# Altium schematic sheet RMP_MAIN_ZERO.SchDoc
size Letter; SheetNumber: 6; SheetTotal: 7
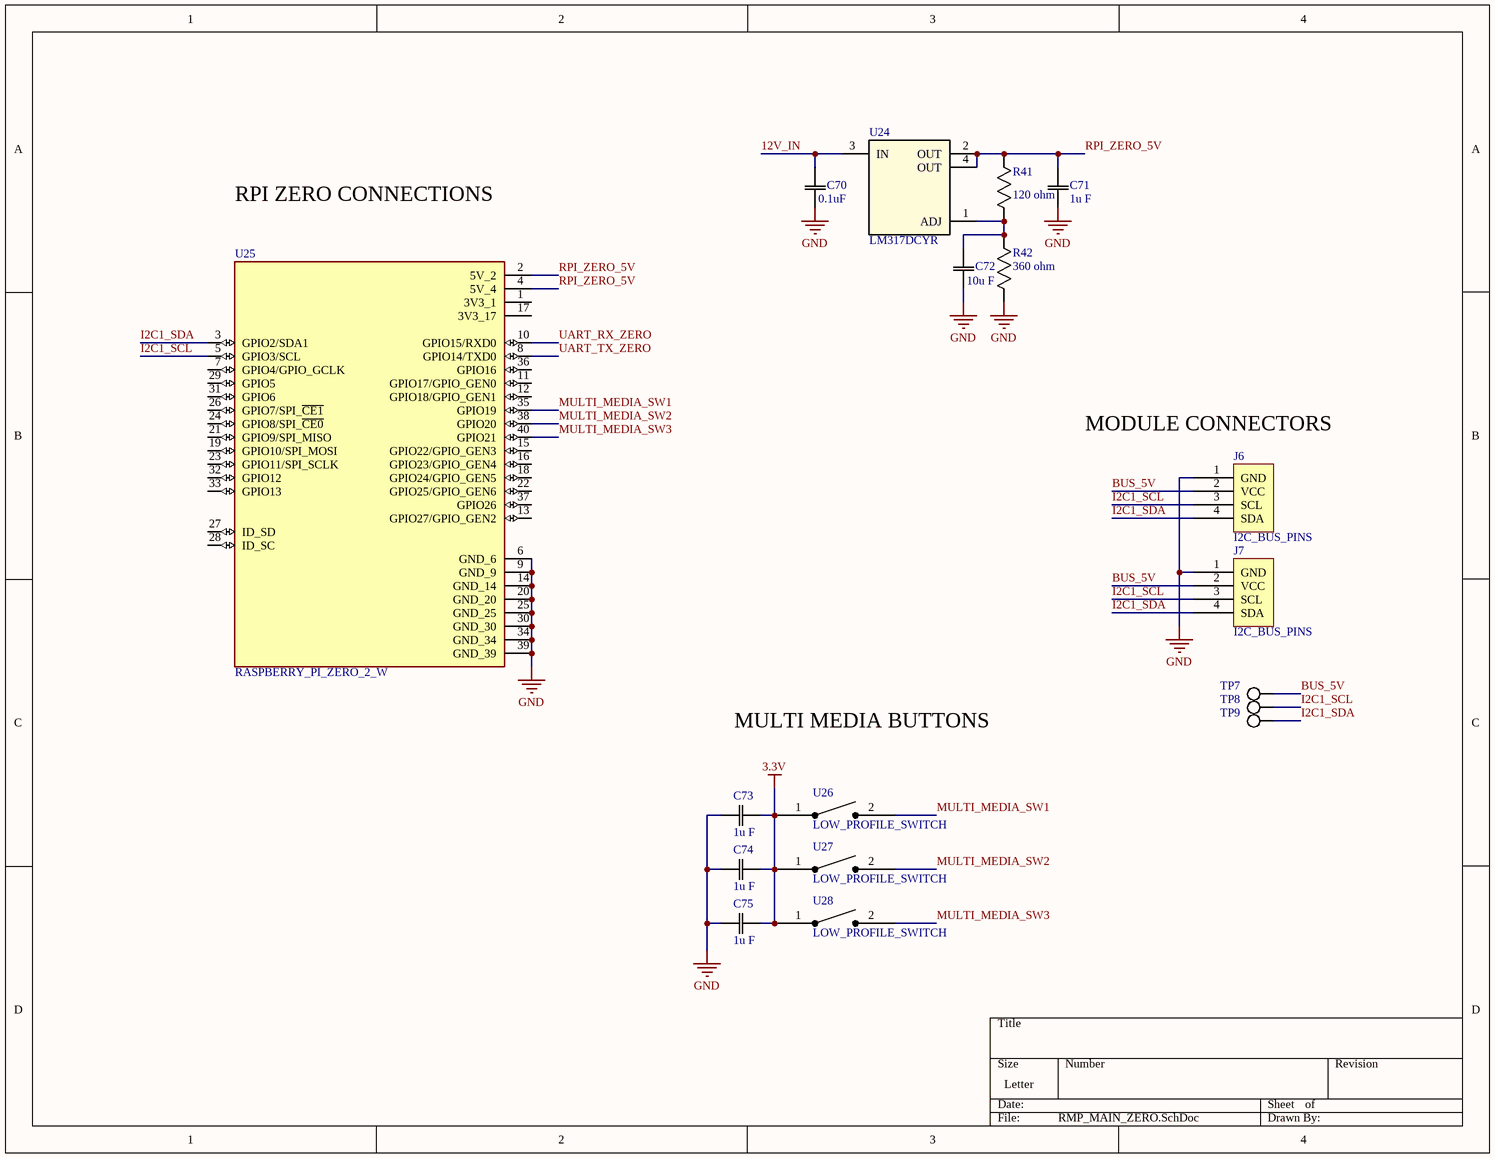
[diagram p0: RMP_MAIN_ZERO.SchDoc]

## Parts
C70  value 0.1uF  [CC0805N_YAG-M]  (hidden comment: CC0805KRX7R9BB104)
C71  value 1u F  [CAP_CL21B105KAFNNNE_SAM-M]  (hidden comment: CL21B105KAFNNNE)
C72  value 10u F  [G-21_MUR-M]  (hidden comment: GRM21BR61C106KE15K)
C73  value 1u F  [CAP_CL21B105KAFNNNE_SAM-M]  (hidden comment: CL21B105KAFNNNE)
C74  value 1u F  [CAP_CL21B105KAFNNNE_SAM-M]  (hidden comment: CL21B105KAFNNNE)
C75  value 1u F  [CAP_CL21B105KAFNNNE_SAM-M]  (hidden comment: CL21B105KAFNNNE)
J6  I2C_BUS_PINS  [4 PIN HEADER]
J7  I2C_BUS_PINS  [4 PIN HEADER]
R41  value 120 ohm  [RES_RNCF0805_STP-M]  (hidden comment: RNCF0805DTE120R)
R42  value 360 ohm  [RES_RNCF0805_STP-M]  (hidden comment: RNCF0805DTE360R)
TP7  TestPoint  [Testpoint]  (value not drawn)
TP8  TestPoint  [Testpoint]  (value not drawn)
TP9  TestPoint  [Testpoint]  (value not drawn)
U24  LM317DCYR  [DCY0004A_M]
U25  RASPBERRY_PI_ZERO_2_W  [MODULE_RASPBERRY_PI_ZERO_2_W]
U26  LOW_PROFILE_SWITCH  [2PINHEADER]
U27  LOW_PROFILE_SWITCH  [2PINHEADER]
U28  LOW_PROFILE_SWITCH  [2PINHEADER]

## Nets
3.3V: C73.1 C74.1 C75.1 U26.1 U27.1 U28.1
GND: C70.1 C71.1 C72.1 C73.2 C74.2 C75.2 J6.1(GND) J7.1(GND) R42.1 U25.6(GND_6) U25.9(GND_9) U25.14(GND_14) U25.20(GND_20) U25.25(GND_25) U25.30(GND_30) U25.34(GND_34) U25.39(GND_39)
12V_IN: C70.2 U24.3(IN)
BUS_5V: J6.2(VCC) J7.2(VCC) TP7.1
I2C1_SCL: J6.3(SCL) J7.3(SCL) TP8.1 U25.5(GPIO3/SCL)
I2C1_SDA: J6.4(SDA) J7.4(SDA) TP9.1 U25.3(GPIO2/SDA1)
MULTI_MEDIA_SW1: U25.35(GPIO19) U26.2
MULTI_MEDIA_SW2: U25.38(GPIO20) U27.2
MULTI_MEDIA_SW3: U25.40(GPIO21) U28.2
RPI_ZERO_5V: C71.2 R41.2 U24.2(OUT) U24.4(OUT) U25.2(5V_2) U25.4(5V_4)
UART_RX_ZERO: U25.10(GPIO15/RXD0)
UART_TX_ZERO: U25.8(GPIO14/TXD0)
NetC72_2: C72.2 R41.1 R42.2 U24.1(ADJ)

Not connected (* = marked no-connect by the designer): U25 1(3V3_1) 7(GPIO4/GPIO_GCLK) 11(GPIO17/GPIO_GEN0) 12(GPIO18/GPIO_GEN1) 13(GPIO27/GPIO_GEN2) 15(GPIO22/GPIO_GEN3) 16(GPIO23/GPIO_GEN4) 17(3V3_17) 18(GPIO24/GPIO_GEN5) 19(GPIO10/SPI_MOSI) 21(GPIO9/SPI_MISO) 22(GPIO25/GPIO_GEN6) 23(GPIO11/SPI_SCLK) 24(GPIO8/SPI_~{CE0}) 26(GPIO7/SPI_~{CE1}) 27(ID_SD) 28(ID_SC) 29(GPIO5) 31(GPIO6) 32(GPIO12) 33(GPIO13) 36(GPIO16) 37(GPIO26)

## Notes on the sheet
- RPI ZERO CONNECTIONS
- (near J6) MODULE CONNECTORS
- MULTI MEDIA BUTTONS

## Library data of the parts
C70 = CAP_CC0805KRX7R9BB104: 0.1 µF ±10% 50V Ceramic Capacitor X7R 0805 (2012 Metric); Mfr_Name: Yageo
C71 C73-C75 = CAP_CL21B105KAFNNNE: 1 µF ±10% 25V Ceramic Capacitor X7R 0805 (2012 Metric); Mfr_Name: Samsung
C72 = CAP_GRM21BR61C106KE15K: 10 µF ±10% 16V Ceramic Capacitor X5R 0805 (2012 Metric); Mfr_Name: Murata
R41 = RES_RNCF0805DTE120R: 120 Ohms ±0.5% 0.25W, 1/4W Chip Resistor 0805 (2012 Metric) Automotive AEC-Q200 Thin Film; Mfr_Name: Stackpole International
R42 = RES_RNCF0805DTE360R: 360 Ohms ±0.5% 0.25W, 1/4W Chip Resistor 0805 (2012 Metric) Automotive AEC-Q200 Thin Film; Mfr_Name: Stackpole International
U24 = LM317DCYR: Linear Voltage Regulator IC Positive Adjustable 1 Output 1.5A SOT-223-4; Mfr_Name: Texas Instruments; SymbolCreater: Altium; TYPE: TYPE; RefDes: RefDes; PartNumber: LM317DCYR; Alternate_PartNumber: LM317DCY; PackageReference: DCY0004A; MountType: SMT; CompType: IC; RoHS: Y; Manufacturer: Texas Instruments
U25 = RASPBERRY_PI_ZERO_2_W: At the heart of Raspberry Pi Zero 2 W is RP3A0, a custom-built system-in-package designed by Raspberry Pi in the UK.; SnapEDA_Link: https://www.snapeda.com/parts/RASPBERRY%20PI%20ZERO%202%20W/Raspberry+Pi/view-part/?ref=snap; Package: None; Value: *; MF: Raspberry Pi; MP: RASPBERRY PI ZERO 2 W; Check_prices: https://www.snapeda.com/parts/RASPBERRY%20PI%20ZERO%202%20W/Raspberry+Pi/view-part/?ref=eda
U26-U28 = LOW_PROFILE_SWITCH: connector for low profile mechanical switch